# Altium schematic sheet TOUCH_GFX.SchDoc
size A1
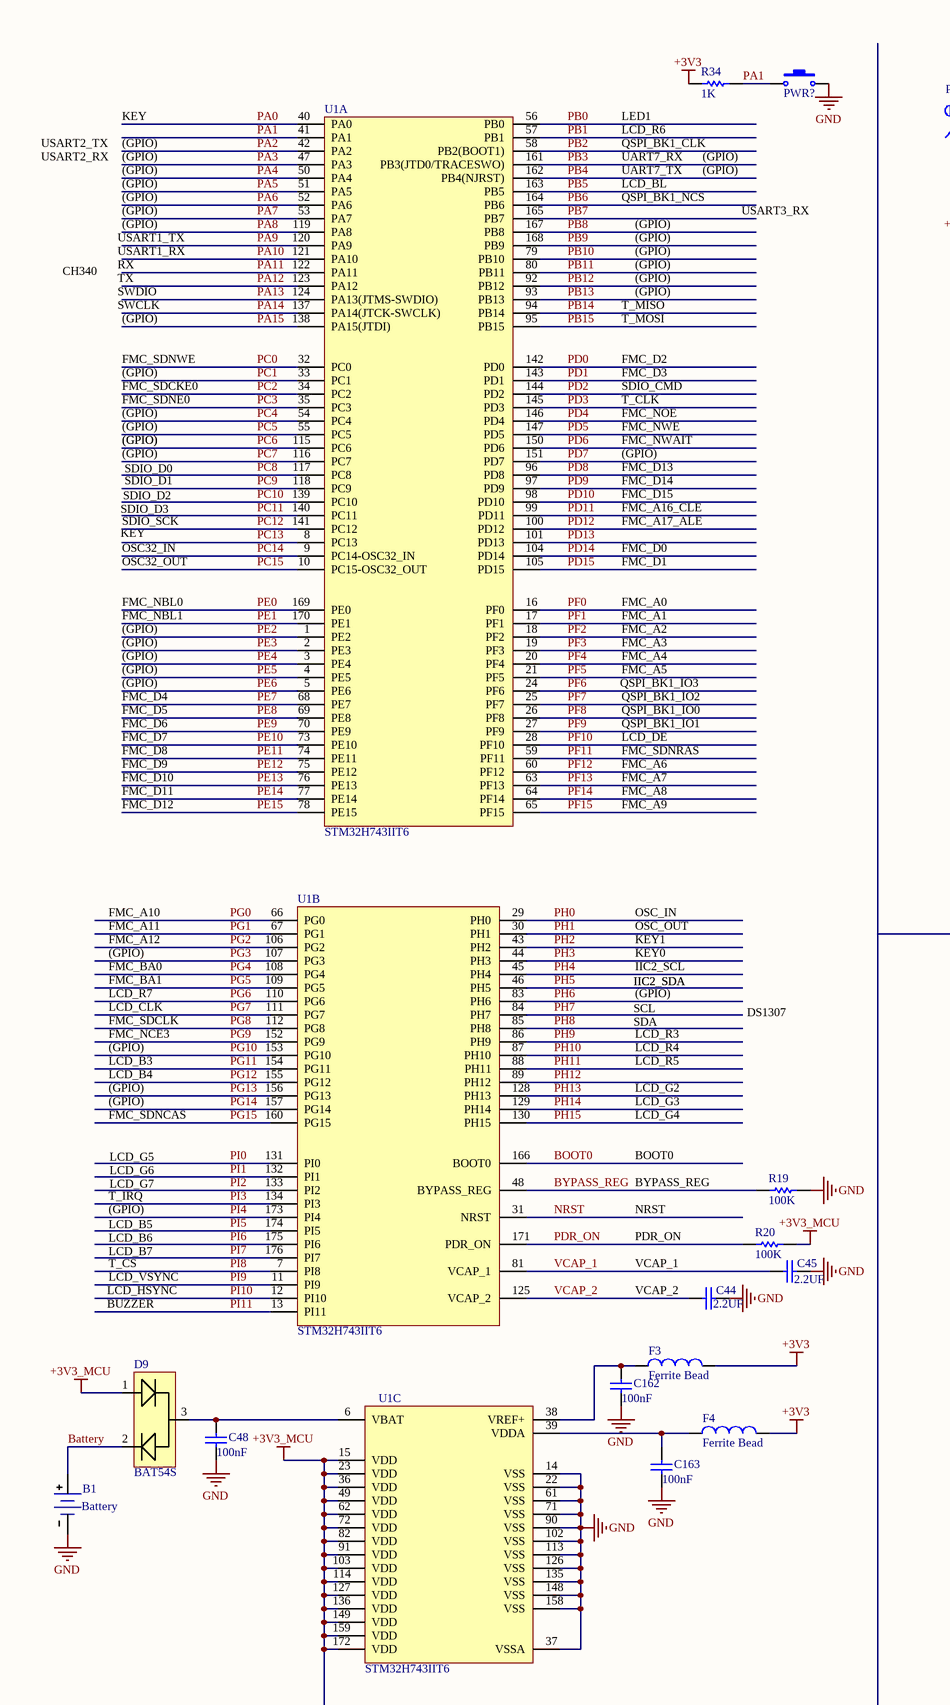
[diagram p0: TOUCH_GFX.SchDoc, top left]
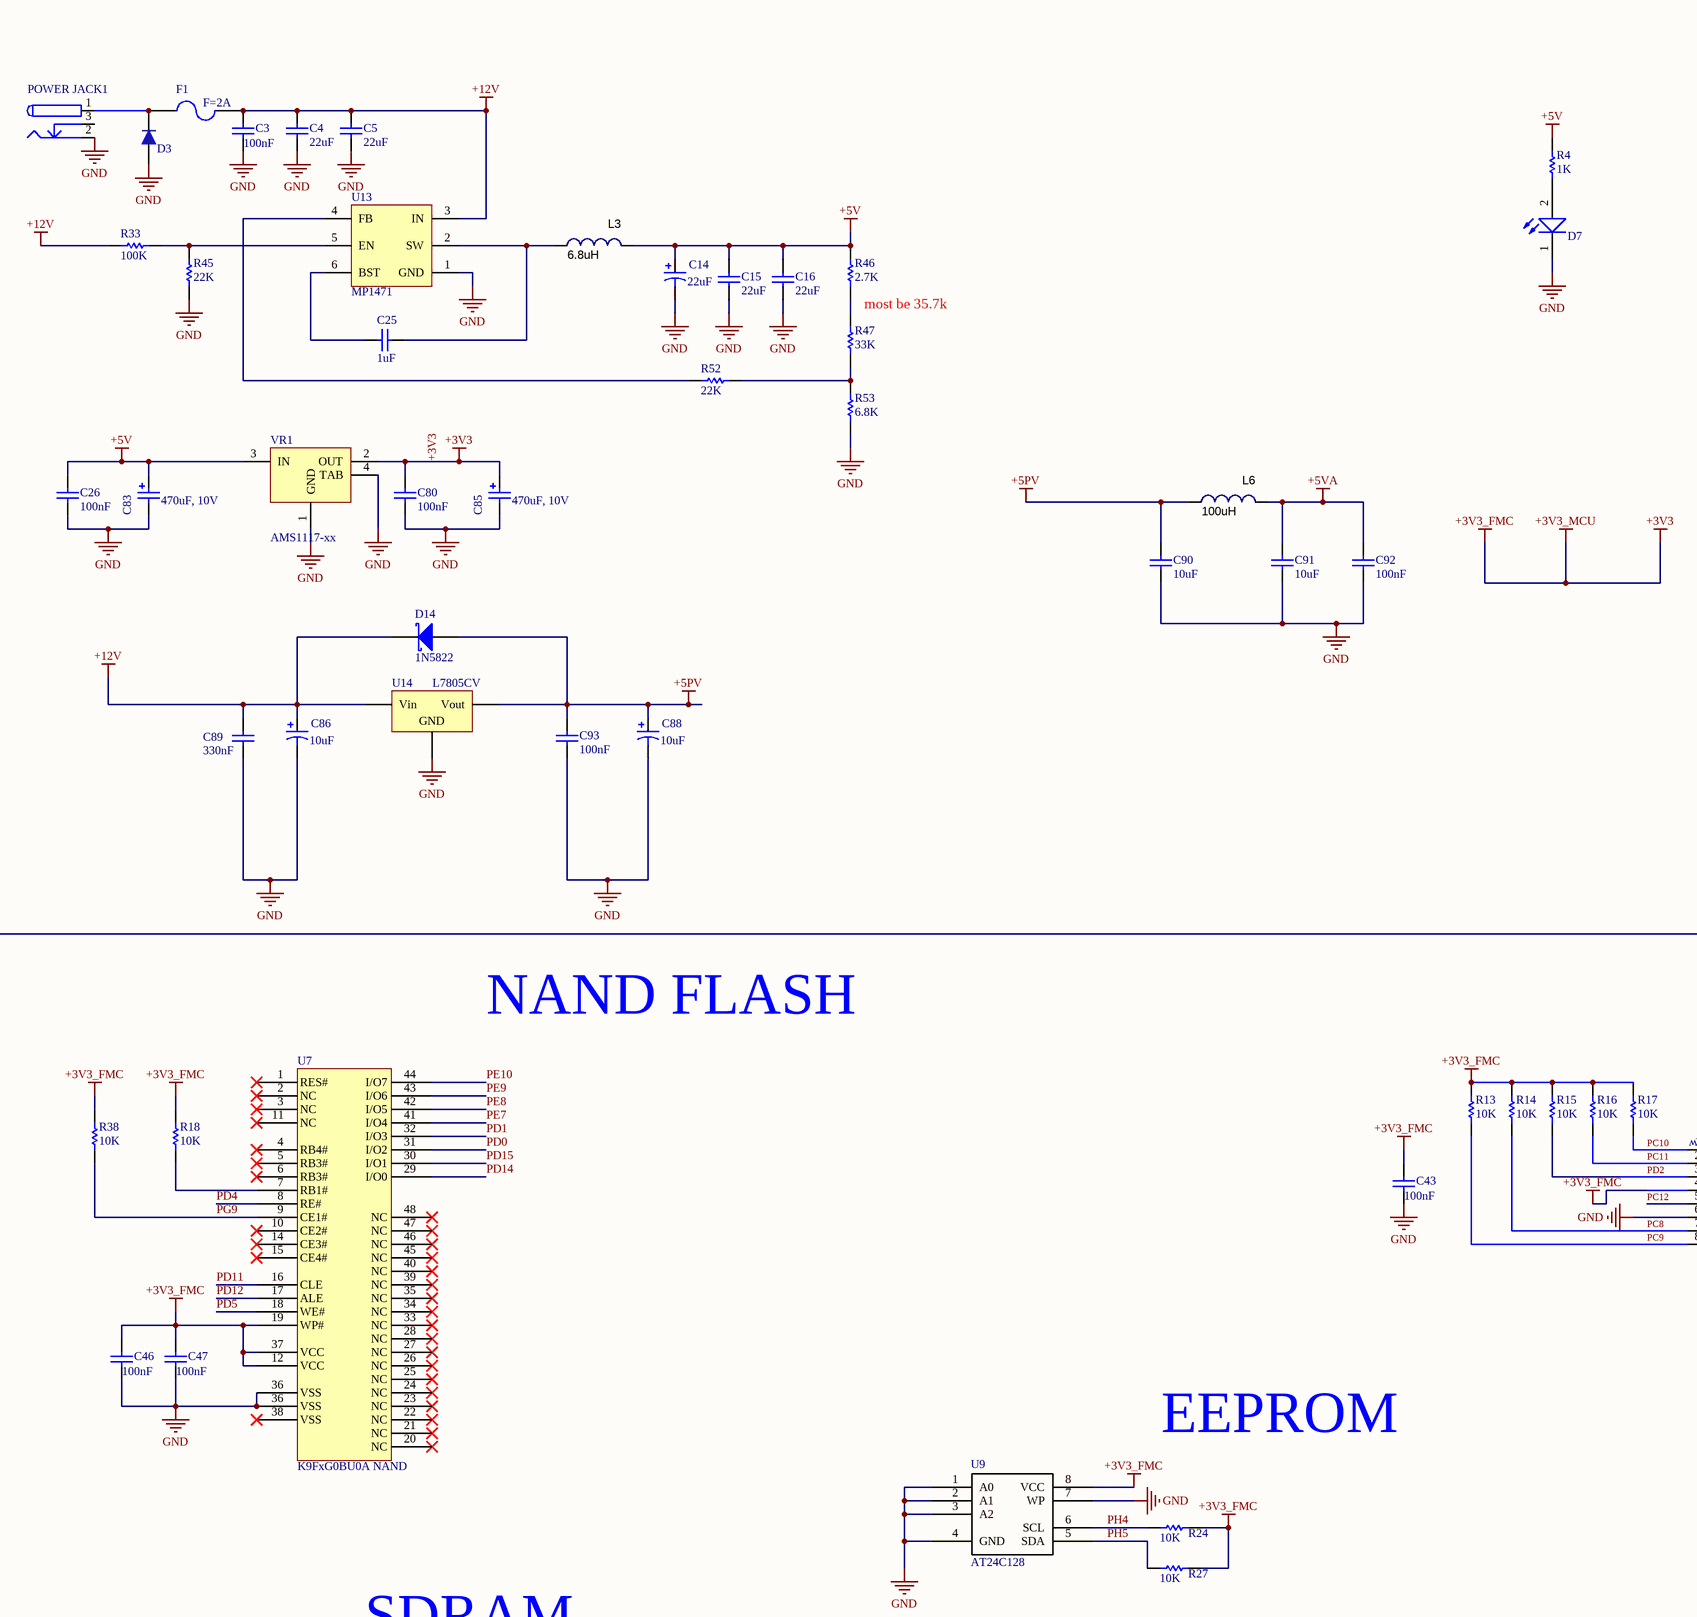
[diagram p1: TOUCH_GFX.SchDoc, top middle]
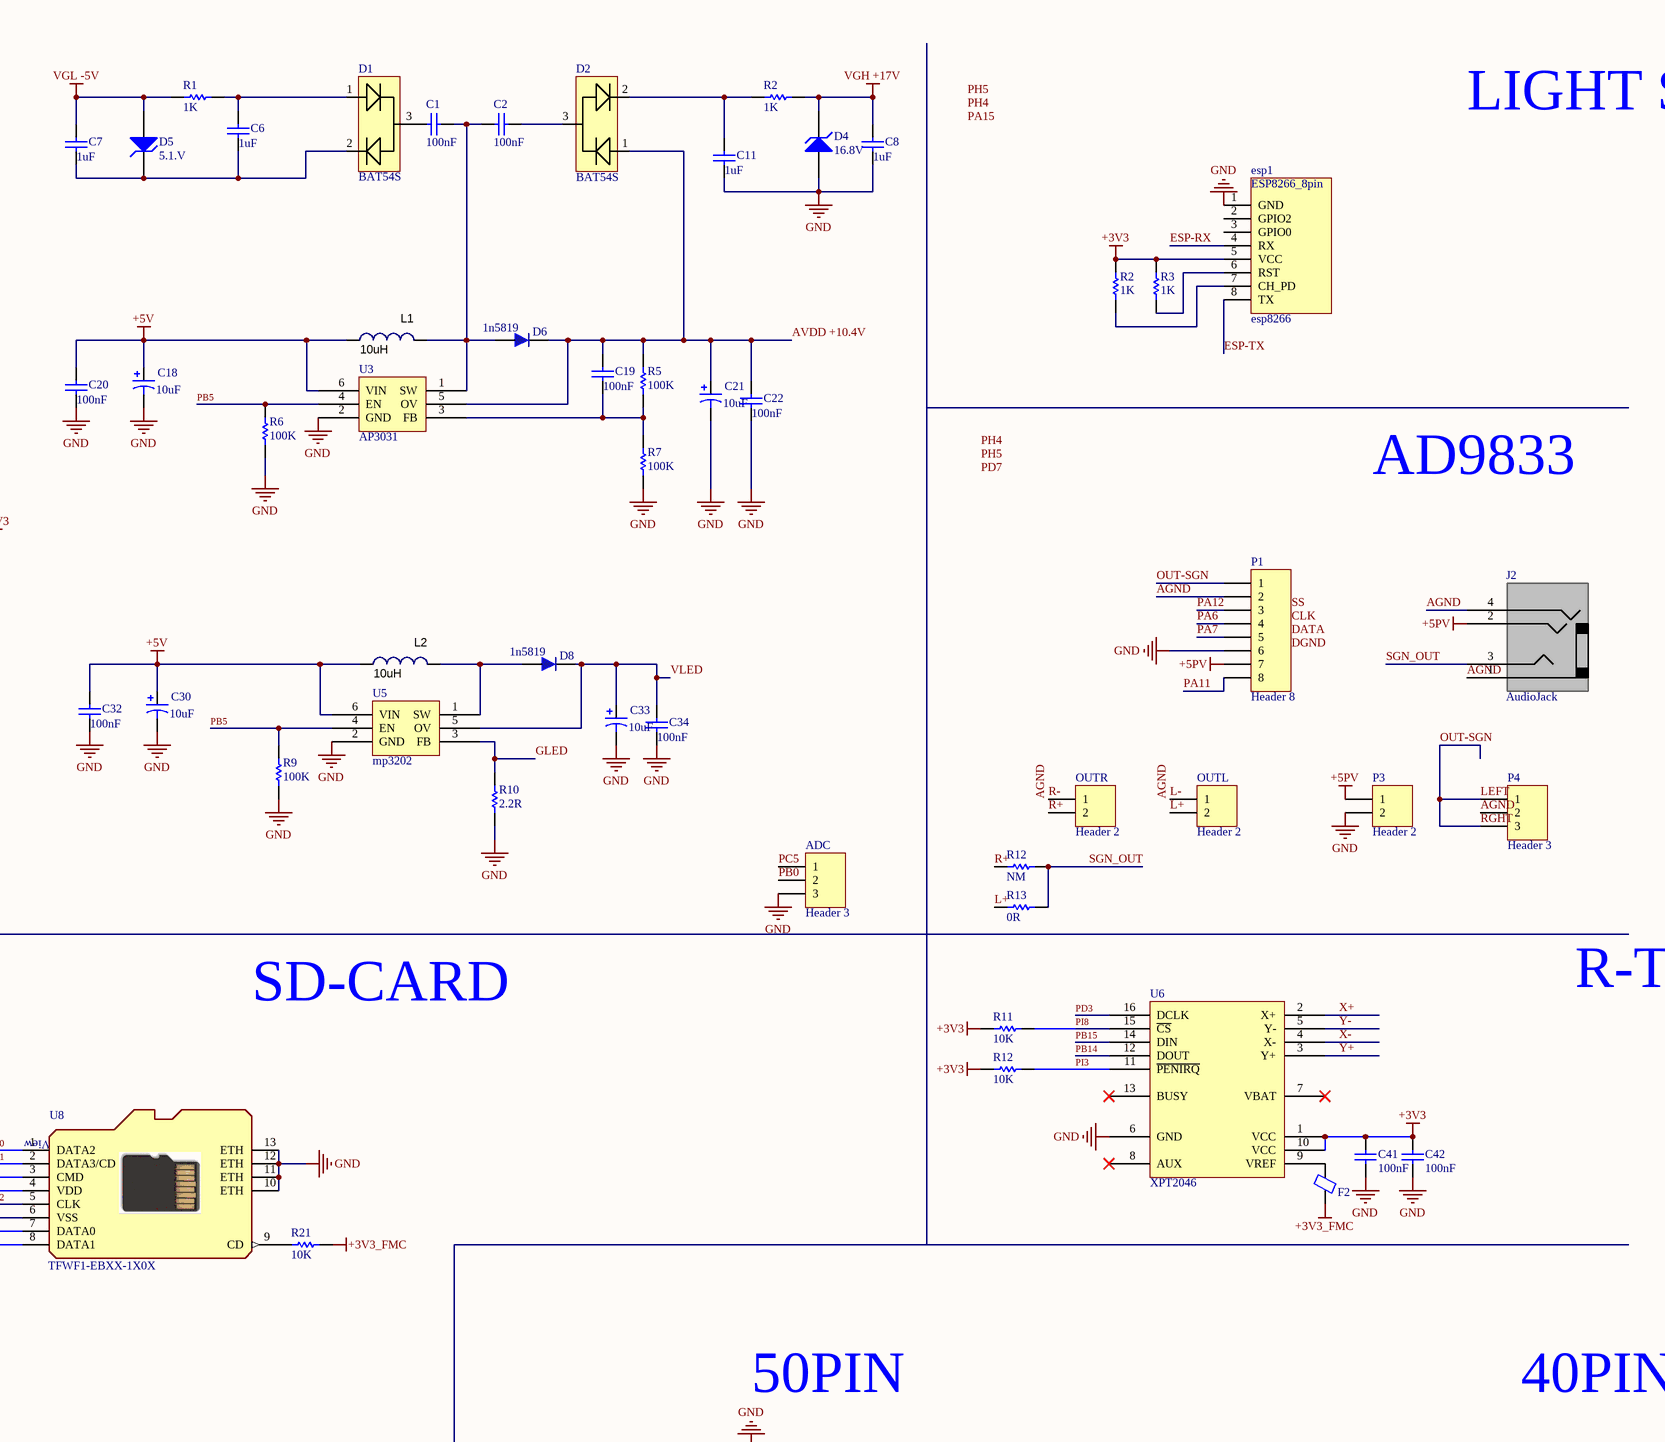
[diagram p2: TOUCH_GFX.SchDoc, top right]
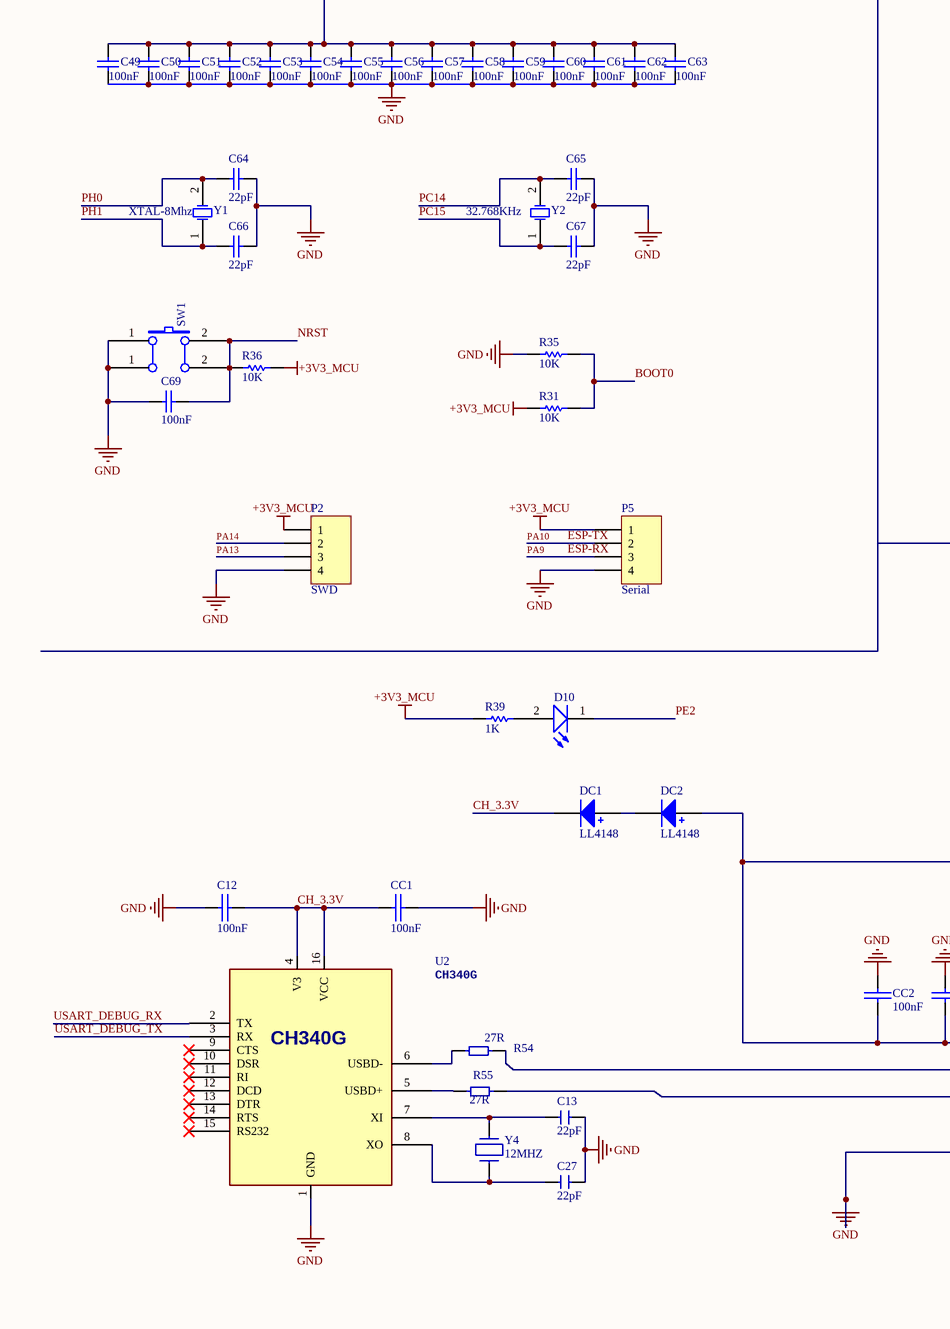
[diagram p3: TOUCH_GFX.SchDoc, bottom left]
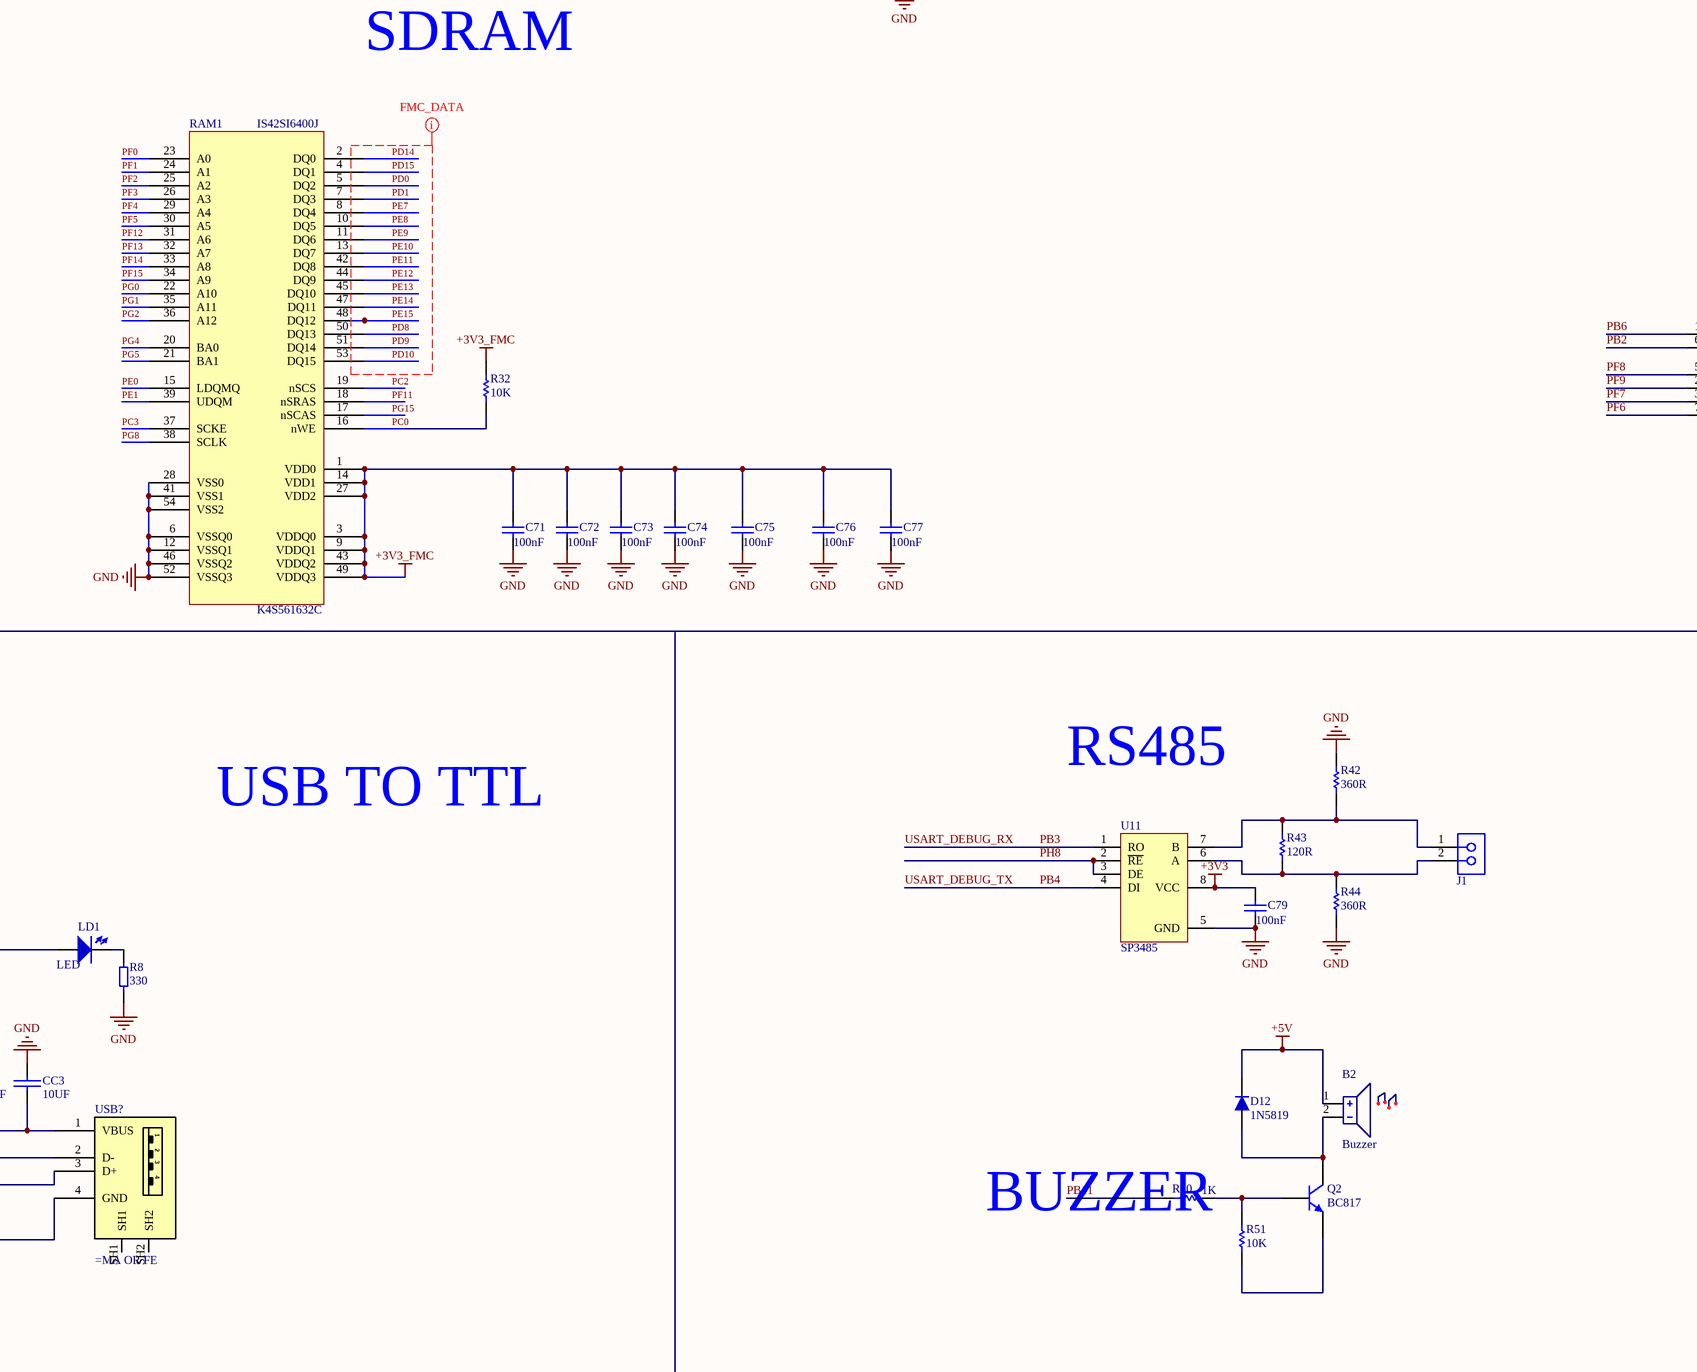
[diagram p4: TOUCH_GFX.SchDoc, bottom middle]
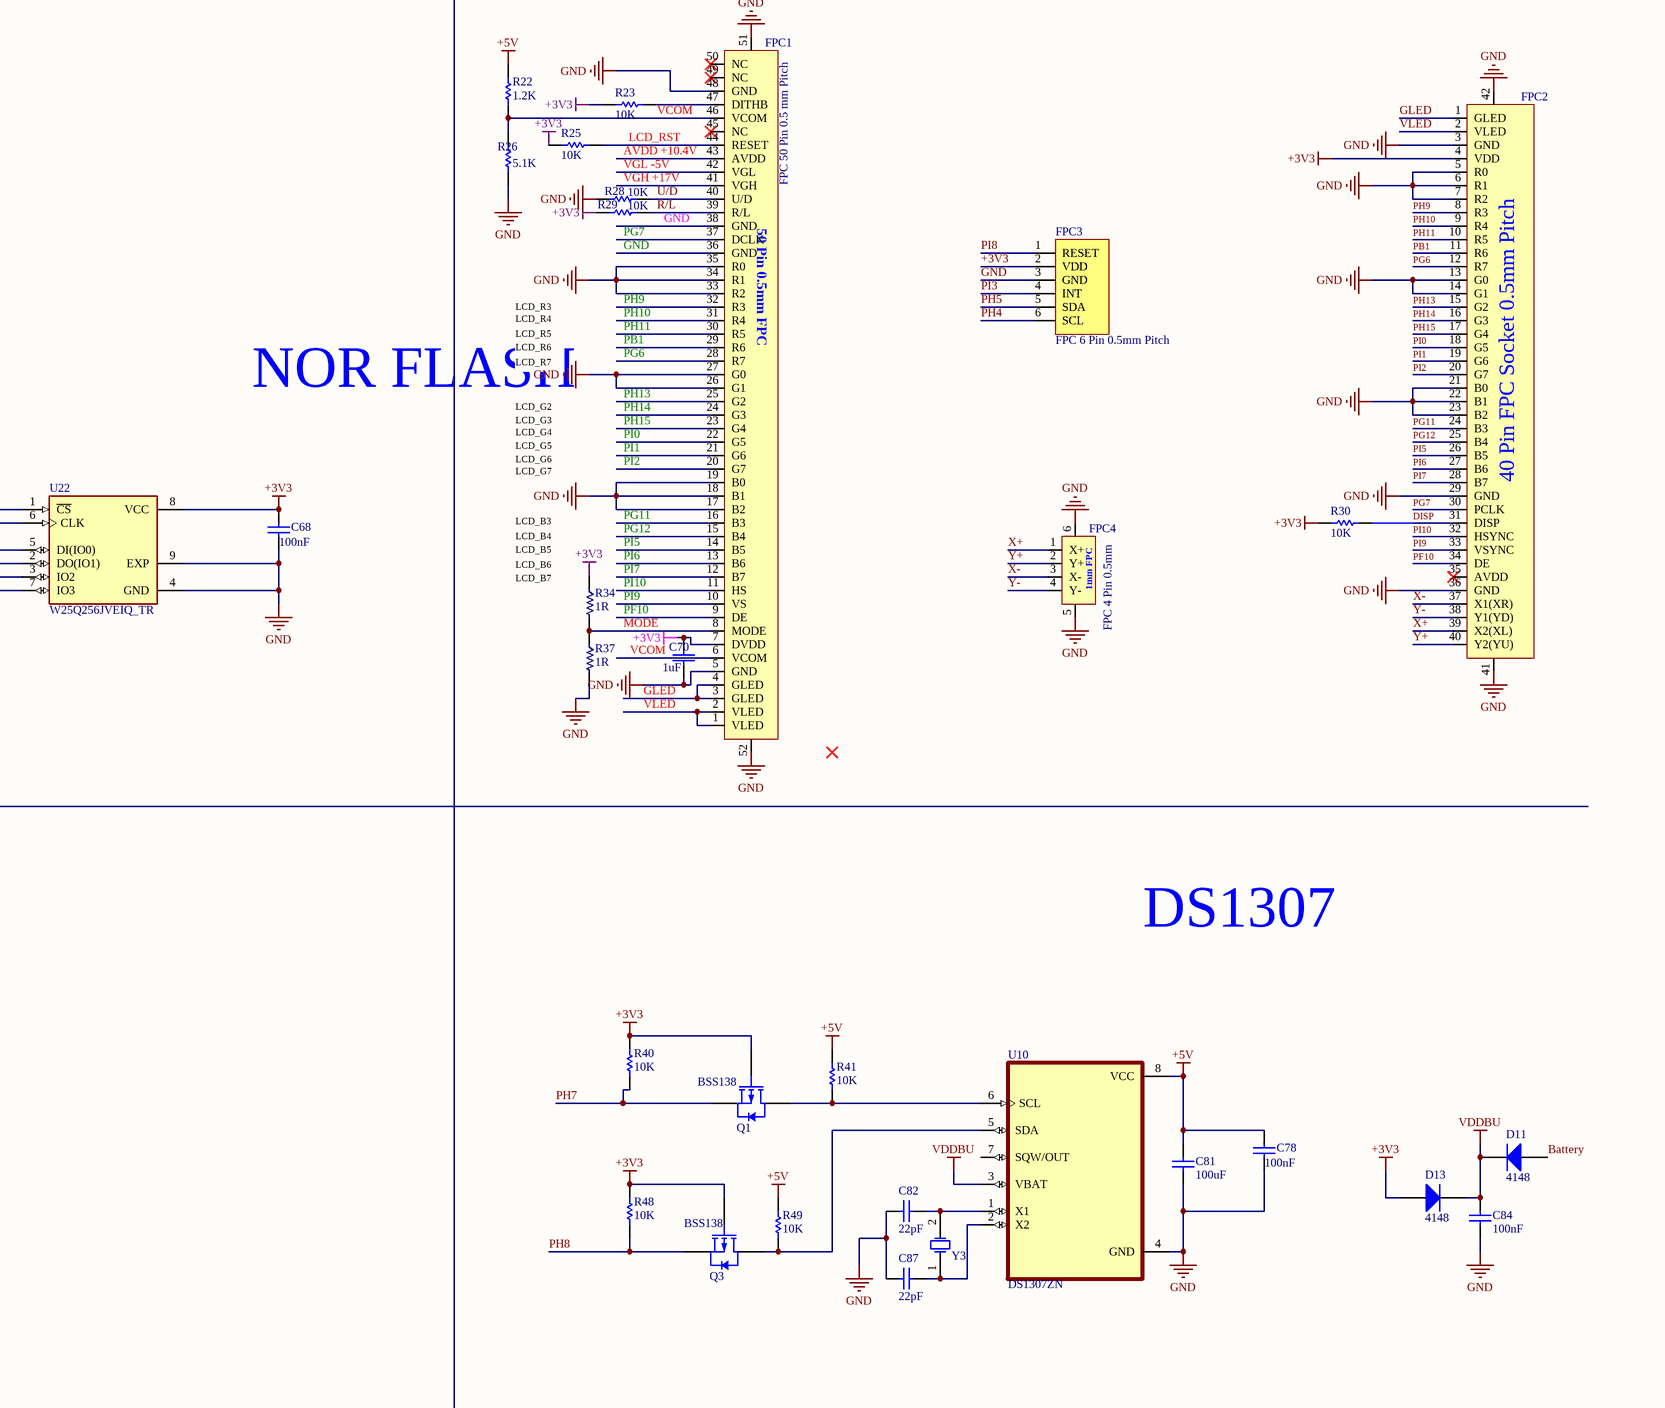
[diagram p5: TOUCH_GFX.SchDoc, bottom right]

## Parts
(Parts that share a designator on the sheet are numbered #1, #2 ... from top to bottom, then left to right.)
ADC  Header 3  [HDR1X3]
B1  Battery  [Battery Holder CR1220]
B2  Buzzer  [BUZZER 2]
C1  100nF  [CAP 805]
C2  100nF  [CAP 805]
C3  100nF  [CAP 805]
C4  value 22uF  [CAP 805]  (hidden comment: Cap)
C5  value 22uF  [CAP 805]  (hidden comment: Cap)
C6  1uF  [CAP 805]
C7  1uF  [CAP 805]
C8  1uF  [CAP 805]
C11  1uF  [CAP 805]
C12  100NF  [C0805]
C13  22PF  [C0805]
C14  value 22uF  [C package]
C15  value 22uF  [CAP 805]  (hidden comment: Cap)
C16  value 22uF  [CAP 805]  (hidden comment: Cap)
C18  value 10uF  [C package]
C19  100nF  [CAP 805]
C20  100nF  [CAP 805]
C21  value 10uF  [C package]
C22  100nF  [CAP 805]
C25  value 1uF  [CAP 805]  (hidden comment: Cap)
C26  value 100nF  [CAP 805]  (hidden comment: Cap)
C27  22PF  [C0805]
C30  value 10uF  [C package]
C32  100nF  [CAP 805]
C33  value 10uF  [C package]
C34  100nF  [CAP 805]
C41  100nF  [CAP 805]
C42  100nF  [CAP 805]
C43  100nF  [CAP 805]
C44  2.2UF  [CAP 805]
C45  2.2UF  [CAP 805]
C46  100nF  [CAP 805]
C47  100nF  [CAP 805]
C48  100nF  [CAP 805]
C49  100nF  [CAP 805]
C50  100nF  [CAP 805]
C51  100nF  [CAP 805]
C52  100nF  [CAP 805]
C53  100nF  [CAP 805]
C54  100nF  [CAP 805]
C55  100nF  [CAP 805]
C56  100nF  [CAP 805]
C57  100nF  [CAP 805]
C58  100nF  [CAP 805]
C59  100nF  [CAP 805]
C60  100nF  [CAP 805]
C61  100nF  [CAP 805]
C62  100nF  [CAP 805]
C63  100nF  [CAP 805]
C64  22pF  [CAP 805]
C65  22pF  [CAP 805]
C66  22pF  [CAP 805]
C67  22pF  [CAP 805]
C68  100nF  [CAP 805]
C69  100nF  [CAP 805]
C70  1uF  [CAP805]
C71  100nF  [CAP 805]
C72  100nF  [CAP 805]
C73  100nF  [CAP 805]
C74  100nF  [CAP 805]
C75  100nF  [CAP 805]
C76  100nF  [CAP 805]
C77  100nF  [CAP 805]
C78  value 100nF  [CAP 805]  (hidden comment: Cap)
C79  100nF  [CAP 805]
C80  value 100nF  [CAP 805]  (hidden comment: Cap)
C81  100uF  [CAP 805]
C82  value 22pF  [CAP 805]  (hidden comment: Cap)
C83  470uF, 10V  [CAP EL 470uF 6,3V]
C84  100nF  [CAP 805]
C85  470uF, 10V  [CAP EL 470uF 6,3V]
C86  value 10uF  [C package]
C87  value 22pF  [CAP 805]  (hidden comment: Cap)
C88  value 10uF  [C package]
C89  value 330nF  [CAP 805]  (hidden comment: Cap)
C90  value 10uF  [CAP 805]  (hidden comment: Cap)
C91  value 10uF  [CAP 805]  (hidden comment: Cap)
C92  value 100nF  [CAP 805]  (hidden comment: Cap)
C93  value 100nF  [CAP 805]  (hidden comment: Cap)
C162  100nF  [CAP 805]
C163  100nF  [CAP 805]
CC1  100NF  [C0805]
CC2  100NF  [C0805]
CC3  value 10UF  [C0805]  (hidden comment: 100NF)
D1  BAT54S  [SOT23]
D2  BAT54S  [SOT23]
D3  1n4007  [Diode 1n4148 SMD]  (value not drawn)
D4  16.8V  [Diode 1n4148 SMD]
D5  5.1.V  [Diode 1n4148 SMD]
D6  1n5819  [DIOM4629X24N]
D7  LED SMD PACKAGE  [LED_SMD_0805]  (value not drawn)
D8  1n5819  [DIOM4629X24N]
D9  BAT54S  [SOT23]
D10  LED SMD PACKAGE  [LED_SMD_0805]  (value not drawn)
D11  4148  [SOD123]
D12  1N5819  [DO-214AA(SMA)]
D13  4148  [SOD123]
D14  1N5822  [DIODE SMA (DO-214AC)]
DC1  LL4148  [DIOD_SMD_1N4148_SOD80]
DC2  LL4148  [DIOD_SMD_1N4148_SOD80]
esp1  esp8266  [esp8266_8pin]
F1  F=2A  [RES_1206]
F2  Ferrite Bead SMD  [IND0805]  (value not drawn)
F3  Ferrite Bead  [RES_0805]
F4  Ferrite Bead  [RES_0805]
FPC1  FPC 50 Pin 0.5 mm Pitch  [FPC 50 Pin 0.5 mm Top Contact]
FPC2  FPC 40 Pin 0.5 mm Pitch  [FPC 40 Pin 0.5 mm Bottom]  (value not drawn)
FPC3  FPC 6 Pin 0.5mm Pitch  [FPC 6 Pin 0.5mm Pitch]
FPC4  FPC 4 Pin 0.5mm  [FPC 4 Pin 0.5mm]
J1  61300211821  [CON_MKDSN1,5/2-5,08]  (value not drawn)
J2  AudioJack  [JCKAS_PJ386]
L1  10uH  [WE-PD_7332_Performance]
L2  10uH  [WE-PD_7332_Performance]
L3  6.8uH  [WE-PD_7332_Performance]
L6  100uH  [IND0805]
LD1  LED  [LED_0805 Y]
OUTL  Header 2  [HDR1X2]
OUTR  Header 2  [HDR1X2]
P1  Header 8  [HDR1X8]
P2  SWD  [HEADER 4X1]
P3  Header 2  [HDR1X2]
P4  Header 3  [HDR1X3]
P5  Serial  [HDR1X4]
POWER_JACK1  DC Power Jack  [694106301002]  (value not drawn)
PWR?  Switch PB  [SW-PB]  (value not drawn)
Q1  BSS138  [SOT23]
Q2  BC817  [SOT-23]
Q3  BSS138  [SOT23]
R1  1K  [RES0805]
R2#1  1K  [RES0805]
R2#2  1K  [RES0805]
R3  1K  [RES0805]
R4  1K  [RES0805]
R5  100K  [RES0805]
R6  100K  [RES0805]
R7  100K  [RES0805]
R8  330R  [0805 Resistor]  (value not drawn)
R9  100K  [RES0805]
R10  2.2R  [RES0805]
R11  10K  [RES0805]
R12#1  NM  [RES0805]
R12#2  10K  [RES0805]
R13#1  0R  [RES0805]
R13#2  10K  [RES0805]
R14  10K  [RES0805]
R15  10K  [RES0805]
R16  10K  [RES0805]
R17  10K  [RES0805]
R18  10K  [RES0805]
R19  100K  [RES0805]
R20  100K  [RES0805]
R21  10K  [RES0805]
R22  1.2K  [RES0805]
R23  10K  [RES0805]
R24  10K  [RES0805]
R25  10K  [RES0805]
R26  5.1K  [RES0805]
R27  10K  [RES0805]
R28  10K  [RES0805]
R29  10K  [RES0805]
R30  10K  [RES0805]
R31  10K  [RES0805]
R32  10K  [RES0805]
R33  100K  [RES0805]
R34#1  1K  [RES0805]
R34#2  1R  [RES0805]
R35  10K  [RES0805]
R36  10K  [RES0805]
R37  1R  [RES0805]
R38  10K  [RES0805]
R39  1K  [RES0805]
R40  10K  [RES_0805]
R41  10K  [RES_0805]
R42  360R  [RES0805]
R43  120R  [RES0805]
R44  360R  [RES0805]
R45  22K  [RES0805]
R46  2.7K  [RES0805]
R47  33K  [RES0805]
R48  10K  [RES_0805]
R49  10K  [RES_0805]
R50  1K  [RES_0805]
R51  10K  [RES_0805]
R52  22K  [RES0805]
R53  6.8K  [RES0805]
R54  27R  [0805 Resistor]
R55  27R  [0805 Resistor]
RAM1  IS42SI6400J  [TSOP54]
SW1  BOTTUN  [SW_KFC]  (value not drawn)
U1  STM32H743IIT6  [LQFP176]  (parts A,B,C of 3)
U2  CH340G  [SO-16]
U3  AP3031  [SOT23-6]
U5  mp3202  [SOT23-6]
U6  XPT2046  [TSSOP65P640X120-16N]
U7  K9FxG0BU0A NAND  [TSOP-48 NAND]
U8  TFWF1-EBXX-1X0X  [SD-Card]
U9  AT24C128  [TSSOP8]
U10  DS1307ZN  [SOIC-8]
U11  SP3485  [SOIC-8]
U13  MP1471  [TSOT23-6]
U14  L7805CV  [TO_263]
U22  W25Q256JVEIQ_TR  [W25Q256]
USB?  (no value)  [SMD_female]
VR1  AMS1117-xx  [SOT-223]
Y1  XTAL-8Mhz  [Xtal2]
Y2  32.768KHz  [Crystal_2]
Y3  32.768kHz, +/-20ppm, 12.5pF  [Crystal_2]  (value not drawn)
Y4  12MHZ  [Xtal 2p]

## Nets
+3V3: C41.2 C42.2 C43.2 C46.2 C47.2 C49.2 C50.2 C51.2 C52.2 C53.2 C54.2 C55.2 C56.2 C57.2 C58.2 C59.2 C60.2 C61.2 C62.2 C63.2 C68.2 C70.1 C71.2 C72.2 C73.2 C74.2 C75.2 C76.2 C77.2 C79.2 C80.2 C85.2(P) D9.1 D13.1(A) esp1.5(VCC) F2.1 F3.2 F4.2 FPC1.7(DVDD) FPC2.4(VDD) FPC3.2(VDD) P2.1 P5.1 Q1.1(G) Q3.1(G) R2#2.1 R3.1 R11.2 R12#2.2 R13#2.1 R14.1 R15.1 R16.1 R17.1 R18.2 R20.1 R21.2 R23.2 R24.1 R25.2 R27.1 R29.2 R30.2 R31.1 R32.1 R34#1.2 R34#2.1 R36.2 R38.2 R39.2 R40.1 R48.1 RAM1.1(VDD0) RAM1.3(VDDQ0) RAM1.9(VDDQ1) RAM1.14(VDD1) RAM1.27(VDD2) RAM1.43(VDDQ2) RAM1.49(VDDQ3) U1.15(VDD) U1.23(VDD) U1.36(VDD) U1.49(VDD) U1.62(VDD) U1.72(VDD) U1.82(VDD) U1.91(VDD) U1.103(VDD) U1.114(VDD) U1.127(VDD) U1.136(VDD) U1.149(VDD) U1.159(VDD) U1.172(VDD) U6.1(VCC) U6.10(VCC) U7.12(VCC) U7.19(WP#) U7.37(VCC) U8.4(VDD) U9.8(VCC) U11.8(VCC) U22.8(VCC) VR1.2(OUT)  [also labelled +3V3_FMC, +3V3_MCU]
+5PV: C88.1 C90.2 C93.2 D14.1(A) J2.2(RING_L) L6.1 P1.7 P3.1 U14.3(Vout)
+5V: B2.1 C14.1 C15.2 C16.2 C18.1 C20.2 C26.2 C30.1 C32.2 C78.1 C81.2 C83.2(P) D12.2 L1.1 L2.1 L3.2 R4.2 R22.2 R41.1 R46.1 R49.1 U3.6(VIN) U5.6(VIN) U10.8(VCC) VR1.3(IN)
+5VA: C91.2 C92.2 L6.2
+12V: C3.2 C4.2 C5.2 C86.1 C89.2 D14.2(K) F1.2 R33.2 U13.3(IN) U14.1(Vin)
GND: ADC.3 B1.2(-) C3.1 C4.1 C5.1 C8.1 C11.1 C12.1(+) C13.1 C14.2 C15.1 C16.1 C18.2 C20.1 C21.2 C22.1 C26.1 C27.2 C30.2 C32.1 C33.2 C34.1 C41.1 C42.1 C43.1 C44.1 C45.1 C46.1 C47.1 C48.1 C49.1 C50.1 C51.1 C52.1 C53.1 C54.1 C55.1 C56.1 C57.1 C58.1 C59.1 C60.1 C61.1 C62.1 C63.1 C64.1 C65.1 C66.1 C67.1 C68.1 C69.2 C70.2 C71.1 C72.1 C73.1 C74.1 C75.1 C76.1 C77.1 C78.2 C79.1 C80.1 C81.1 C82.2 C83.1(N) C84.1 C85.1(N) C86.2 C87.2 C88.2 C89.1 C90.1 C91.1 C92.1 C93.1 C162.1 C163.1 CC1.2(-) CC2.2(-) CC3.2(-) D3.1 D4.1(A) D7.1(K) esp1.1(GND) FPC1.5(GND) FPC1.17(B2) FPC1.18(B1) FPC1.19(B0) FPC1.26(G1) FPC1.27(G0) FPC1.33(R2) FPC1.34(R1) FPC1.35(R0) FPC1.36(GND) FPC1.38(GND) FPC1.48(GND) FPC1.51 FPC1.52 FPC2.3(GND) FPC2.5(R0) FPC2.6(R1) FPC2.7(R2) FPC2.13(G0) FPC2.14(G1) FPC2.21(B0) FPC2.22(B1) FPC2.23(B2) FPC2.29(GND) FPC2.36(GND) FPC2.41 FPC2.42 FPC3.3(GND) FPC4.5 FPC4.6 P1.6 P2.4 P3.2 P5.4 POWER_JACK1.2 PWR?.2 R6.2 R7.2 R8.2 R9.2 R10.1 R19.1 R26.1 R28.2 R35.1 R37.2 R42.1 R44.2 R45.2 R53.2 RAM1.6(VSSQ0) RAM1.12(VSSQ1) RAM1.28(VSS0) RAM1.41(VSS1) RAM1.46(VSSQ2) RAM1.52(VSSQ3) RAM1.54(VSS2) SW1.1(A0) U1.14(VSS) U1.22(VSS) U1.37(VSSA) U1.61(VSS) U1.71(VSS) U1.90(VSS) U1.102(VSS) U1.113(VSS) U1.126(VSS) U1.135(VSS) U1.148(VSS) U1.158(VSS) U2.1(GND) U3.2(GND) U5.2(GND) U6.6(GND) U7.36(VSS) U8.6(VSS) U8.10(ETH) U8.11(ETH) U8.12(ETH) U8.13(ETH) U9.1(A0) U9.2(A1) U9.3(A2) U9.4(GND) U9.7(WP) U10.4(GND) U11.5(GND) U13.1(GND) U14.2(GND) U22.4(GND) U22.9(EXP) USB?.4(GND) VR1.1(GND) VR1.4(TAB)
VDDBU: C84.2 D11.2(K) D13.2(K) U10.3(VBAT)
VGH +17V: C8.2 D4.2(K) FPC1.41(VGH) R2#1.1
VGL -5V: C7.2 D5.1(A) FPC1.42(VGL) R1.2
AGND: J2.1(SLEEVE) J2.4(SN-NO) OUTL.1 OUTR.1 P1.2 P4.2  [also labelled L-, R-]
AVDD +10.4V: C19.2 C21.1 C22.2 D2.1 D6.2 FPC1.43(AVDD) R5.1 U3.5(OV)
Battery: B1.1(+) D9.2 D11.1(A)
BOOT0: R31.2 R35.2 U1.166(BOOT0)
BYPASS_REG: R19.2 U1.48(BYPASS_REG)
CH_3.3V: C12.2(-) CC1.1(+) DC1.2(K) U2.4(V3) U2.16(VCC)
DISP: FPC2.31(DISP) R30.1
ESP-RX: esp1.4(RX) P5.3 U1.120(PA9)  [also labelled PA9]
ESP-TX: esp1.8(TX) P5.2 U1.121(PA10)  [also labelled PA10]
GLED: FPC1.3(GLED) FPC1.4(GLED) FPC2.1(GLED) R10.2 U5.3(FB)
L+: OUTL.2 R13#1.2
LCD_RST: FPC1.44(RESET) R25.1
LEFT: P1.1 P4.1 P4.3  [also labelled OUT-SGN, RGHT]
MODE: FPC1.8(MODE) R34#2.2 R37.1
NRST: C69.1 R36.1 SW1.2(B1) U1.31(NRST)
PA0: U1.40(PA0)
PA1: PWR?.1 R34#1.1 U1.41(PA1)
PA2: U1.42(PA2)
PA3: U1.47(PA3)
PA4: U1.50(PA4)
PA5: U1.51(PA5)
PA6: P1.4 U1.52(PA6)
PA7: P1.5 U1.53(PA7)
PA8: U1.119(PA8)
PA11: P1.8 U1.122(PA11)
PA12: P1.3 U1.123(PA12)
PA13: P2.3 U1.124(PA13(JTMS-SWDIO))
PA14: P2.2 U1.137(PA14(JTCK-SWCLK))
PA15: U1.138(PA15(JTDI))
PB0: ADC.2 U1.56(PB0)
PB1: FPC1.29(R6) FPC2.11(R6) U1.57(PB1)
PB2: U1.58(PB2(BOOT1)) U22.6(CLK)
PB3: U1.161(PB3(JTD0/TRACESWO)) U2.2(TX) U11.1(RO)  [also labelled USART_DEBUG_RX]
PB4: U1.162(PB4(NJRST)) U2.3(RX) U11.4(DI)  [also labelled USART_DEBUG_TX]
PB5: R6.1 R9.1 U1.163(PB5) U3.4(EN) U5.4(EN)
PB6: U1.164(PB6) U22.1(~{CS})
PB7: U1.165(PB7)
PB8: U1.167(PB8)
PB9: U1.168(PB9)
PB10: U1.79(PB10)
PB11: R50.2 U1.80(PB11)
PB12: U1.92(PB12)
PB13: U1.93(PB13)
PB14: U1.94(PB14) U6.12(DOUT)
PB15: U1.95(PB15) U6.14(DIN)
PC0: R32.2 RAM1.16(nWE) U1.32(PC0)
PC1: U1.33(PC1)
PC2: RAM1.19(nSCS) U1.34(PC2)
PC3: RAM1.37(SCKE) U1.35(PC3)
PC4: U1.54(PC4)
PC5: ADC.1 U1.55(PC5)
PC6: U1.115(PC6)
PC7: U1.116(PC7)
PC8: R14.2 U1.117(PC8) U8.7(DATA0)
PC9: R13#2.2 U1.118(PC9) U8.8(DATA1)
PC10: R17.2 U1.139(PC10) U8.1(DATA2)
PC11: R16.2 U1.140(PC11) U8.2(DATA3/CD)
PC12: U1.141(PC12) U8.5(CLK)
PC13: U1.8(PC13)
PC14: C65.2 U1.9(PC14-OSC32_IN) Y2.2(OSC2)
PC15: C67.2 U1.10(PC15-OSC32_OUT) Y2.1(OSC1)
PD0: RAM1.5(DQ2) U1.142(PD0) U7.31(I/O2)
PD1: RAM1.7(DQ3) U1.143(PD1) U7.32(I/O3)
PD2: R15.2 U1.144(PD2) U8.3(CMD)
PD3: U1.145(PD3) U6.16(DCLK)
PD4: U1.146(PD4) U7.8(RE#)
PD5: U1.147(PD5) U7.18(WE#)
PD6: U1.150(PD6)
PD7: U1.151(PD7)
PD8: RAM1.50(DQ13) U1.96(PD8)
PD9: RAM1.51(DQ14) U1.97(PD9)
PD10: RAM1.53(DQ15) U1.98(PD10)
PD11: U1.99(PD11) U7.16(CLE)
PD12: U1.100(PD12) U7.17(ALE)
PD13: U1.101(PD13)
PD14: RAM1.2(DQ0) U1.104(PD14) U7.29(I/O0)
PD15: RAM1.4(DQ1) U1.105(PD15) U7.30(I/O1)
PDR_ON: R20.2 U1.171(PDR_ON)
PE0: RAM1.15(LDQMQ) U1.169(PE0)
PE1: RAM1.39(UDQM) U1.170(PE1)
PE2: D10.1(K) U1.1(PE2)
PE3: U1.2(PE3)
PE4: U1.3(PE4)
PE5: U1.4(PE5)
PE6: U1.5(PE6)
PE7: RAM1.8(DQ4) U1.68(PE7) U7.41(I/O4)
PE8: RAM1.10(DQ5) U1.69(PE8) U7.42(I/O5)
PE9: RAM1.11(DQ6) U1.70(PE9) U7.43(I/O6)
PE10: RAM1.13(DQ7) U1.73(PE10) U7.44(I/O7)
PE11: RAM1.42(DQ8) U1.74(PE11)
PE12: RAM1.44(DQ9) U1.75(PE12)
PE13: RAM1.45(DQ10) U1.76(PE13)
PE14: RAM1.47(DQ11) U1.77(PE14)
PE15: RAM1.48(DQ12) U1.78(PE15)
PF0: RAM1.23(A0) U1.16(PF0)
PF1: RAM1.24(A1) U1.17(PF1)
PF2: RAM1.25(A2) U1.18(PF2)
PF3: RAM1.26(A3) U1.19(PF3)
PF4: RAM1.29(A4) U1.20(PF4)
PF5: RAM1.30(A5) U1.21(PF5)
PF6: U1.24(PF6) U22.7(IO3)
PF7: U1.25(PF7) U22.3(IO2)
PF8: U1.26(PF8) U22.5(DI(IO0))
PF9: U1.27(PF9) U22.2(DO(IO1))
PF10: FPC1.9(DE) FPC2.34(DE) U1.28(PF10)
PF11: RAM1.18(nSRAS) U1.59(PF11)
PF12: RAM1.31(A6) U1.60(PF12)
PF13: RAM1.32(A7) U1.63(PF13)
PF14: RAM1.33(A8) U1.64(PF14)
PF15: RAM1.34(A9) U1.65(PF15)
PG0: RAM1.22(A10) U1.66(PG0)
PG1: RAM1.35(A11) U1.67(PG1)
PG2: RAM1.36(A12) U1.106(PG2)
PG3: U1.107(PG3)
PG4: RAM1.20(BA0) U1.108(PG4)
PG5: RAM1.21(BA1) U1.109(PG5)
PG6: FPC1.28(R7) FPC2.12(R7) U1.110(PG6)
PG7: FPC1.37(DCLK) FPC2.30(PCLK) U1.111(PG7)
PG8: RAM1.38(SCLK) U1.112(PG8)
PG9: R38.1 U1.152(PG9) U7.9(CE1#)
PG10: U1.153(PG10)
PG11: FPC1.16(B3) FPC2.24(B3) U1.154(PG11)
PG12: FPC1.15(B4) FPC2.25(B4) U1.155(PG12)
PG13: U1.156(PG13)
PG14: U1.157(PG14)
PG15: RAM1.17(nSCAS) U1.160(PG15)
PH0: C64.2 U1.29(PH0) Y1.2(OSC2)
PH1: C66.2 U1.30(PH1) Y1.1(OSC1)
PH2: U1.43(PH2)
PH3: U1.44(PH3)
PH4: FPC3.6(SCL) R24.2 U1.45(PH4) U9.6(SCL)
PH5: FPC3.5(SDA) R27.2 U1.46(PH5) U9.5(SDA)
PH6: U1.83(PH6)
PH7: Q1.2(S) R40.2 U1.84(PH7)
PH8: Q3.2(S) R48.2 U1.85(PH8) U11.2(~{RE}) U11.3(DE)
PH9: FPC1.32(R3) FPC2.8(R3) U1.86(PH9)
PH10: FPC1.31(R4) FPC2.9(R4) U1.87(PH10)
PH11: FPC1.30(R5) FPC2.10(R5) U1.88(PH11)
PH12: U1.89(PH12)
PH13: FPC1.25(G2) FPC2.15(G2) U1.128(PH13)
PH14: FPC1.24(G3) FPC2.16(G3) U1.129(PH14)
PH15: FPC1.23(G4) FPC2.17(G4) U1.130(PH15)
PI0: FPC1.22(G5) FPC2.18(G5) U1.131(PI0)
PI1: FPC1.21(G6) FPC2.19(G6) U1.132(PI1)
PI2: FPC1.20(G7) FPC2.20(G7) U1.133(PI2)
PI3: FPC3.4(INT) R12#2.1 U1.134(PI3) U6.11(~{PENIRQ})
PI4: U1.173(PI4)
PI5: FPC1.14(B5) FPC2.26(B5) U1.174(PI5)
PI6: FPC1.13(B6) FPC2.27(B6) U1.175(PI6)
PI7: FPC1.12(B7) FPC2.28(B7) U1.176(PI7)
PI8: FPC3.1(RESET) R11.1 U1.7(PI8) U6.15(~{CS})
PI9: FPC1.10(VS) FPC2.33(VSYNC) U1.11(PI9)
PI10: FPC1.11(HS) FPC2.32(HSYNC) U1.12(PI10)
PI11: U1.13(PI11)
R+: OUTR.2 R12#1.2
R/L: FPC1.39(R/L) R29.1
SGN_OUT: J2.3(TIP_R) R12#1.1 R13#1.1
U/D: FPC1.40(U/D) R28.1
VCAP_1: C45.2 U1.81(VCAP_1)
VCAP_2: C44.2 U1.125(VCAP_2)
VCOM: FPC1.6(VCOM) FPC1.46(VCOM) R22.1 R26.2
VLED: C33.1 C34.2 D8.2 FPC1.1(VLED) FPC1.2(VLED) FPC2.2(VLED) U5.5(OV)
X+: FPC2.39(X2(XL)) FPC4.1(X+) U6.2(X+)
X-: FPC2.37(X1(XR)) FPC4.3(X-) U6.4(X-)
Y+: FPC2.40(Y2(YU)) FPC4.2(Y+) U6.3(Y+)
Y-: FPC2.38(Y1(YD)) FPC4.4(Y-) U6.5(Y-)
NetB2_2: B2.2 D12.1 Q2.3(C)
NetC1_1: C1.1 C2.2 D6.1 L1.2 U3.1(SW)
NetC1_2: C1.2 D1.3
NetC2_1: C2.1 D2.3
NetC6_1: C6.1 C7.1 D1.2 D5.2(K)
NetC6_2: C6.2 D1.1 R1.1
NetC11_2: C11.2 D2.2 R2#1.2
NetC13_2: C13.2 U2.7(XI) Y4.2
NetC19_1: C19.1 R5.2 R7.1 U3.3(FB)
NetC25_1: C25.1 U13.6(BST)
NetC25_2: C25.2 L3.1 U13.2(SW)
NetC27_1: C27.1 U2.8(XO) Y4.1
NetC48_2: C48.2 D9.3 U1.6(VBAT)
NetC82_1: C82.1 U10.1(X1) Y3.2(OSC2)
NetC87_1: C87.1 U10.2(X2) Y3.1(OSC1)
NetC162_2: C162.2 F3.1 U1.38(VREF+)
NetC163_2: C163.2 F4.1 U1.39(VDDA)
NetCC2_1: CC2.1(+) CC3.1(+) DC2.1(A) LD1.1(A) USB?.1(VBUS)
NetD3_2: D3.2 F1.1 POWER_JACK1.1
NetD7_2: D7.2(A) R4.1
NetD8_1: D8.1 L2.2 U5.1(SW)
NetD10_2: D10.2(A) R39.1
NetDC1_1: DC1.1(A) DC2.2(K)
Netesp1_6: esp1.6(RST) R3.2
Netesp1_7: esp1.7(CH_PD) R2#2.2
NetF2_2: F2.2 U6.9(VREF)
NetFPC1_47: FPC1.47(DITHB) R23.1
NetJ1_1: J1.1 R42.2 R43.1 U11.7(B)
NetJ1_2: J1.2 R43.2 R44.1 U11.6(A)
NetLD1_2: LD1.2(K) R8.1
NetQ1_3: Q1.3(D) R41.2 U10.6(SCL)
NetQ2_1: Q2.1(B) R50.1 R51.1
NetQ2_2: Q2.2(E) R51.2
NetQ3_3: Q3.3(D) R49.2 U10.5(SDA)
NetR18_1: R18.1 U7.7(RB1#)
NetR21_1: R21.1 U8.9(CD)
NetR33_1: R33.1 R45.1 U13.5(EN)
NetR46_2: R46.2 R47.1
NetR47_2: R47.2 R52.2 R53.1
NetR52_1: R52.1 U13.4(FB)
NetR54_1: R54.1 U2.6(USBD-)
NetR54_2: R54.2 USB?.2(D-)
NetR55_1: R55.1 U2.5(USBD+)
NetR55_2: R55.2 USB?.3(D+)

Not connected (* = marked no-connect by the designer): esp1 2(GPIO2) 3(GPIO0); FPC1 45(NC)* 49(NC)* 50(NC)*; FPC2 35(AVDD)*; POWER_JACK1 3; U2 9(CTS)* 10(DSR)* 11(RI)* 12(DCD)* 13(DTR)* 14(RTS)* 15(RS232)*; U6 7(VBAT)* 8(AUX)* 13(BUSY)*; U7 1(RES#)* 2(NC)* 3(NC)* 4(RB4#)* 5(RB3#)* 6(RB3#)* 10(CE2#)* 11(NC)* 14(CE3#)* 15(CE4#)* 20(NC)* 21(NC)* 22(NC)* 23(NC)* 24(NC)* 25(NC)* 26(NC)* 27(NC)* 28(NC)* 33(NC)* 34(NC)* 35(NC)* 38(VSS)* 39(NC)* 40(NC)* 45(NC)* 46(NC)* 47(NC)* 48(NC)*; U10 7(SQW/OUT); USB? SH1 SH2

## Layout directives
net class FMC_DATA; rule Length Constraint [Min Length = 0mm    Max Length = 28mm]: PD0, PD1, PD8, PD9, PD10, PD14, PD15, PE7, PE8, PE9, PE10, PE11, PE12, PE13, PE14, PE15

## Notes on the sheet
- KEY
- LED1
- LCD_R6
- LIGHT SENSOR
- USART2_TX
- USART2_RX
- (GPIO)
- QSPI_BK1_CLK
- UART7_RX
- UART7_TX
- LCD_BL
- QSPI_BK1_NCS
- USART1_TX
- USART1_RX
- RX
- USART3_RX
- CH340
- TX
- SWDIO
- SWCLK
- T_MISO
- T_MOSI
- most be 35.7k
- FMC_SDNWE
- FMC_SDNE0
- FMC_SDCKE0
- FMC_D2
- FMC_D3
- SDIO_CMD
- T_CLK
- SDIO_D0
- FMC_NOE
- FMC_NWE
- FMC_NWAIT
- FMC_D13
- SDIO_D3
- SDIO_SCK
- SDIO_D2
- SDIO_D1
- FMC_D14
- FMC_D15
- FMC_A16_CLE
- FMC_A17_ALE
- AD9833
- OSC32_IN
- OSC32_OUT
- FMC_NBL0
- FMC_D0
- FMC_D1
- FMC_A0
- FMC_NBL1
- FMC_A1
- FMC_A2
- FMC_A3
- FMC_A4
- FMC_A5
- FMC_D4
- FMC_D5
- FMC_D6
- FMC_D7
- QSPI_BK1_IO3
- QSPI_BK1_IO2
- QSPI_BK1_IO0
- QSPI_BK1_IO1
- LCD_DE
- FMC_D8
- FMC_D9
- FMC_D10
- FMC_D11
- FMC_D12
- FMC_SDNRAS
- FMC_A6
- FMC_A7
- FMC_A8
- FMC_A9
- FMC_A10
- FMC_A11
- FMC_A12
- OSC_IN
- OSC_OUT
- KEY1
- FMC_BA0
- FMC_BA1
- LCD_R7
- LCD_CLK
- IIC2_SDA
- SCL
- KEY0
- IIC2_SCL
- DS1307
- SD-CARD
- R-TOUCH
- FMC_SDCLK
- FMC_NCE3
- LCD_B3
- LCD_B4
- SDA
- LCD_R3
- LCD_R4
- LCD_R5
- NAND FLASH
- FMC_SDNCAS
- LCD_G2
- LCD_G3
- LCD_G4
- T_IRQ
- LCD_G5
- LCD_G6
- LCD_G7
- BOOT0
- BYPASS_REG
- NRST
- LCD_B5
- LCD_B6
- LCD_B7
- T_CS
- LCD_VSYNC
- PDR_ON
- (near C44) VCAP_1
- LCD_HSYNC
- BUZZER
- (near C44) VCAP_2
- 50PIN
- 40PIN
- (near U9) EEPROM
- SDRAM
- NOR FLASH
- (near R34#2) LCD_B4
- (near R34#2) LCD_B5
- (near R34#2) LCD_B6
- (near R34#2) LCD_B7
- RS485
- USB TO TTL
- Labels drawn without touching a wire or pin: CLK, DATA, DGND, PA15, PD7, PH4, PH5, SS
- (in symbol Capacitor SMD) 22pF
- (in symbol esp8266_8pin) ESP8266_8pin
- (in symbol FPC 4 Pin 0.5mm) 1mm FPC
- (in symbol FPC 40 Pin 0.5 mm Pitch) 40 Pin FPC Socket 0.5mm Pitch
- (in symbol FPC 50 Pin 0.5 mm Pitch) 50 Pin 0.5mm FPC
- (in symbol Resistor SMD) 330
- (in symbol TFWF1-EBXX-1X0X) Card Bottom View

## Library data of the parts
ADC P4 = Header 3: Header, 3-Pin; LatestRevisionDate: 17-Jul-2002; LatestRevisionNote: Re-released for DXP Platform.; Publisher: Altium Limited
B1 = Battry Backup
B2 = Buzzer New
C1-C3 C6-C8 C11 C19 C20 C22 C32 C34 C41-C69 C71-C77 C79 C162 C163 = CAP SMD 1206: CAP 1206; Designer: Abbas Basereh; Desc.: CAP SMD 1206; Data: 16-12-2016
C4 C5 C15 C16 C25 C26 C78 C80 C82 C87 C89-C93 = Cap: Capacitor; Published: 8-Jun-2000; LatestRevisionDate: 17-Jul-2002; LatestRevisionNote: Re-released for DXP Platform.; PackageReference: RAD-0.3; Publisher: Altium Limited
C12 CC1-CC3 = Cap-Bipolar: Bipolar Capacitor; Voltage: 100V; Designer: Saeid Jorablo; Organazation: ControTec; Adding Date: 1387/12/20
  C12 CC1 CC2: Value: 100nF
C13 C27 = Capacitor SMD
C14 C18 C21 C30 C33 C86 C88 = Cap Pol1: Polarized Capacitor (Radial); pin to pad: 1>2 2>1; Published: 8-Jun-2000; LatestRevisionDate: 17-Jul-2002; LatestRevisionNote: Re-released for DXP Platform.; PackageReference: RB7.6-15; Publisher: Altium Limited
C70 = Cap CBB22 105J400V: Polypropylene film with epoxy Cap CBB22 105J400V; Manufacturer: CHINA; Designer: Abbas Basereh; Data: 16-12-2016; Link: https://www.alibaba.com/product-detail/CBB22-capacitors-105J-400V-1UF-400V_60020643516.html; Part. No: 105J400V
C81 = 885342008008: WCAP-CSMH Ceramic Capacitors, size 1206, 22pF, 1000VDC; Ceramic Type: NP0 Class I; Insulation Resistance: 10GOhm; Technical Reference: NP01206220JA00DFCT10000; ComponentLink1Description: Manufacturer; ComponentLink1URL: http://www.we-online.de; ComponentLink2Description: Datasheet; ComponentLink2URL: https://katalog.we-online.com/pbs/datasheet/885342008008.pdf; Packaging: Tape and Reel; Part Number: 885342008008; Published Date: August 2019; Rated Voltage: 1000VDC; Size: 1206; Mounting Technology: SMD; Publisher: Wurth Elektronik; Capacitance: 22pF; Dissipation Factor: -; Operating Temperature: -55 to +125degC
C83 C85 = 860010274015: WCAP-ATG8 THT Aluminum Electrolytic Capacitors, D8mm x L16mm, 1000uF, +/-20%, 10VDC; Dissipation Factor: 19%; Endurance: 2000h; Leakage Current: 100uA; Ripple Current max.: 725mA; Technical Reference: ATBE160102M010DSPA7B000; ComponentLink1Description: Manufacturer; ComponentLink1URL: http://www.we-online.de; ComponentLink2Description: Datasheet; ComponentLink2URL: https://katalog.we-online.com/pbs/datasheet/860010274015.pdf; Length: 16mm; Mounting Technology: THT; Operating Temperature: -40 to +85degC; Packaging: Ammo Pack; Published Date: August 2019; Capacitance: 1000uF; Diameter: 8mm; Part Number: 860010274015; Publisher: Wurth Elektronik; Capacitance Tolerance: +/-20%; Rated Voltage: 10VDC
C84 = 885342007004: WCAP-CSMH Ceramic Capacitors, size 0805, 15pF, 250VDC; Ceramic Type: NP0 Class I; Insulation Resistance: 10GOhm; Technical Reference: NP00805150J250DFCT10000; ComponentLink1Description: Manufacturer; ComponentLink1URL: http://www.we-online.de; ComponentLink2Description: Datasheet; ComponentLink2URL: https://katalog.we-online.com/pbs/datasheet/885342007004.pdf; Packaging: Tape and Reel; Part Number: 885342007004; Published Date: August 2019; Rated Voltage: 250VDC; Size: 0805; Mounting Technology: SMD; Publisher: Wurth Elektronik; Capacitance: 15pF; Dissipation Factor: -; Operating Temperature: -55 to +125degC
D1 D2 D9 = BAV99: switiching diode
D3 D6 D8 = 1n4007 SMD M7: Standard Rectifiers; Part. No: M7; Manufacturer: DC COMPONENTS; Designer: Abbas Basereh; Link: http://www.tme.eu/en/details/m7/smd-universal-diodes/dc-components/; Link: https://www.aliexpress.com/item/Smd-tube-1n4007-m7-SMA/1213719741.html?spm=2114.01010208.3.1.ZyZ7bC&ws_ab_test=searchweb0_0,searchweb201602_4_10065_10068_10084_10083_10080_10082_10081_10060_10061_10062_10056_10055_10054_10059_10099_10078_10079_427_10073_10103_10102_10096_10052_10050_10051,searchweb201603_4&btsid=db2be5ca-e560-400a-b91c-484ab5ee228b; Data: 16-12-2016
D4 D5 = D Zener: Zener Diode; Published: 8-Jun-2000; LatestRevisionDate: 17-Jul-2002; LatestRevisionNote: Re-released for DXP Platform.; PackageReference: DIODE-0.7; Publisher: Altium Limited; PackageDescription: Diode, Thru-Hole; 2 Leads; 0.7 in Pin Spacing
D7 D10 = LED SMD PACKAGE: SMD Mono-color Chip LED Waterclear; Part Number: 150080BS75000; Peak Wavelength: 465 nm; Forward Voltage: 3.2 V; Published Date: Jan 2017; Publisher: Ali Hafizi
D11 D13 = Diode: Default Diode; Published: 8-Jun-2000; LatestRevisionDate: 17-Jul-2002; LatestRevisionNote: Re-released for DXP Platform.; PackageVersion: Sep-1996; PackageReference: SMC; Publisher: Altium Limited; PackageDescription: DO-214-AB/SMC; 2 C-Bend Leads; Body 7.9 x 5.9 mm, inc. leads (LxW); Code_JEDEC: DO-214-AB
D12 = 1N5819(SS14)
D14 = 1N5822: Silicon RF Schottky Diode for Mixer Applications in the VHF/UHF Range; Published: 21-Mar-2003; PackageVersion: Sep-2001; PackageReference: SMC; Publisher: Altium Limited
DC1 DC2 = DIOD
esp1 = esp8266_8pin
F1 = Fuse 5x20 with holdeer pins: Fuses 5x20; Designer: Abbas Basereh; Desc.: fuse with holder pins 5x20; Data: 28-12-2016
F2 = Ferrite Bead SMD Package: Designer: Ali Hafizi
F3 F4 = Ferrite Bead: Code_IEC: 1005; Published: 8-Jun-2000; LatestRevisionDate: 29-May-2009; LatestRevisionNote: IPC-7351 Footprint Added.; PackageReference: 0402-A; Publisher: Altium Limited; PackageDescription: Chip Inductor; Code_JEITA: 0402
J1 = 61300211821: WR-PHD Socket Header, THT, pitch 2.54mm, Single Row, Vertical, 2pin; Pin Number: 2; Gender: Female; Rated Current: 3A; Working Voltage: 250VAC; Withstanding Voltage: 500VAC; Contact Resistance: 20mOhm; ComponentLink1Description: Manufacturer; ComponentLink1URL: http://www.we-online.de; ComponentLink2Description: Datasheet; ComponentLink2URL: https://katalog.we-online.de/em/datasheet/6130xx11821.pdf; Part Number: 61300211821; Published Date: June 2019; Publisher: Wurth Elektronik; Pitch: 2.54mm; Operating Temperature: -40 to +125degC; Mounting Technology: THT; Packaging: Tray; Row Number: Single; Orientation: Vertical
J2 = JACKA3.5SMD_TSH-3864D: Jack, Audio, Stereo, 3.5mm, RA, SMD; MANF: Champway; MANF_P#: TSH-3864D; VALUE: AudioJack
L1-L3 L6 = Inductor 4.7µH SMD 3x3.2mm: Tolerance: ±20%; Type: Ferrite Core; SCDType: source; Package / Case: Inductor 4.7µH SMD 3x3.2mm; Supplier 1: Digi-Key; Operating Temperature: -40°C ~ 125°C
LD1 = LED SMD
OUTL OUTR P3 = Header 2: Header, 2-Pin; LatestRevisionDate: 17-Jul-2002; LatestRevisionNote: Re-released for DXP Platform.; Publisher: Altium Limited
P1 = Header 8: Header, 8-Pin; LatestRevisionDate: 17-Jul-2002; LatestRevisionNote: Re-released for DXP Platform.; Publisher: Altium Limited
P2 P5 = Header 4: Header, 4-Pin; LatestRevisionDate: 17-Jul-2002; LatestRevisionNote: Re-released for DXP Platform.; Publisher: Altium Limited
POWER_JACK1 = DC Power Jack: DC Power Jack. Center Pin 2.5mm. Diameter: 5.7mm; Designer: Ali Hafizi; Company: Personal; Project Name: Laser; Adding Date: 10/21/2009
PWR? = Switch PB: Push Button Switch
Q1 Q3 = BSS84: P-channel Enhancement Mode Vertical D-MOSFET; Published: 17-Sep-2003; LatestRevisionDate: 12-Dec-2006; LatestRevisionNote: IPC-7351 Footprint Added.; DatasheetVersion: 18-Jun-1997; PackageVersion: May-1999; PackageReference: SOT23; Publisher: Altium Limited; PackageDescription: 3-Pin SOT-23 Package 0.95 mm Pitch, 2.3 mm Lead Span; ComponentLink1Description: Manufacturer Link; ComponentLink1URL: http://www.semiconductors.philips.com/; ComponentLink2Description: Datasheet; ComponentLink2URL: http://www.semiconductors.philips.com/acrobat/datasheets/BSS84_3.pdf
R1 R2#1 R2#2 R3 R4 R34#1 R39 = res1: Resistor; Published: 8-Jun-2000; Revision: July-2002: Re-released for DXP Platform.; Publisher: Altium Limited; Value: 1K
R5-R7 R9-R11 R12#1 R12#2 R13#1 R13#2 R14-R29 R31-R33 R35 R36 R38 R42-R47 R52 R53 = res1: Resistor; Value: 1K; Published: 8-Jun-2000; Revision: July-2002: Re-released for DXP Platform.; Publisher: Altium Limited
R8 R54 R55 = Resistor SMD
R30 = RES 0805 0.125W: RES 0805; Designer: Abbas Basereh; Desc.: RES SMD 0805; Data: 16-12-2016
R34#2 R37 = res
R40 R41 R48-R51 = ERQF06: Flat Chip Fuse Resistor, 0.47 Ohm to 10 Ohm Range, 5% Tolerance, 0805 Size, 0.1 W; Note: If flow soldering, adjust pad width of PCB Footprint to 0.7 - 0.8 times the width of the resistor.; Published: 17-Dec-2003; LatestRevisionDate: 19-Mar-2004; LatestRevisionNote: Silkscreen size reduced.; PackageDocument: Mar-2003; PackageReference: 6-0805; Publisher: Altium Limited; Code_IPC: 2012 [0805]; ComponentLink1Description: Manufacturer Link; ComponentLink1URL: http://www.panasonic.com/industrial/components/resistive_products.htm; ComponentLink2Description: Datasheet; ComponentLink2URL: http://www.panasonic.com/industrial/components/pdf/AOB0000CE1.pdf
RAM1 = K4S561632C
SW1 = SW PUSHBUTTON: SE PUSHBUTTON
U2 = CH340G_SOP16: USB-UART; MANF_P#: CH340G; VALUE: CH340G
U3 = mp3202
U6 = XPT2043
U7 = K9FxG0BU0A NAND: NAND FLASH
U8 = TFWF1-EBXX-1X0X: T-Flash 8pin SMT; Manufacturer: Wellco T&C Co., Ltd.; Link to Datasheet: *; Link to Picture: *; Operating Temp: *; Rating: *; Stability Frequency: *; Storage Temp: *; Tolerance: *; ComponentLink1Description: *; ComponentLink1URL: *; Manufacture Part #: TFWF1-EBXX-1X0X; Value: TFWF1-EBXX-1X0X
U9 = 24C02-TSSOP: I2C EEPROM 256b X 8; Supplier 1: Digi-Key; Supplier Part Number 1: 497-4926-1-ND
U10 = DS1307ZN: Real Time Clock _RTC_ IC Clock/Calendar 56B IÂ²C, 2-Wire Serial 8-SOIC _0.154, 3.90mm Width_; MP: DS1307ZN+; MF: Maxim Integrated; Price: None; SnapEDA_Link: https://www.snapeda.com/parts/DS1307ZN%2B/Maxim%20Integrated/view-part/100626/?ref=snap; Package: SOIC-8 Maxim; Value: *; Availability: Unavailable
U14 = L7805CV-Linear Voltage Regulator: Linear Voltage Regulator IC Positive FIXED Output 5V 1.5A TO-220AB; Manufacturer: STMicroelectronics; Designer: Abbas Basereh; Link: https://www.aliexpress.com/item/; Link: http://www.tme.eu/en/; Link: http://www.digikey.com/; Part. No: L7805CV
U22 = W25Q256JVEIQ_TR: FLASH - NOR Memory IC 256Mb _32M x 8_ SPI - Quad I/O 133MHz 8-WSON _8x6_; MF: Winbond; MP: W25Q256JVEIQ TR; Value: *; Package: WSON-8 Winbond; Availability: Unavailable; SnapEDA_Link: https://www.snapeda.com/parts/W25Q256JVEIQ%20TR/Winbond%20Electronics/view-part/652108/?ref=snap; Price: None
USB? = USB_CONNECTOR
VR1 = AMS1117
Y1 Y2 = XTAL: Crystal Oscillator; Published: 8-Jun-2000; LatestRevisionDate: 17-Jul-2002; LatestRevisionNote: Re-released for DXP Platform.; PackageReference: R38; Publisher: Altium Limited
Y3 = 830002995B: WE-XTAL Quartz Crystal, size WATCH, 32.768kHz, +/-20ppm, 12.5pF; ComponentLink1Description: Manufacturer; ComponentLink1URL: http://www.we-online.de; ComponentLink2Description: Datasheet; ComponentLink2URL: https://katalog.we-online.com/pbs/datasheet/830002995B.pdf; Part Number: 830002995B; Published Date: March 2019; Publisher: Wurth Elektronik; Size: WATCH; Frequency Stability: -; Operating Temperature: -40 up to +85degC; Mounting Technology: THT; Packaging: Bulk; Load Capacitance: 12.5pF; Frequency Tolerance: +/-20ppm; Frequency: 32.768kHz
Y4 = Xtal